# Altium schematic sheet Power.SchDoc
size A4; SheetNumber: 3; SheetTotal: 3
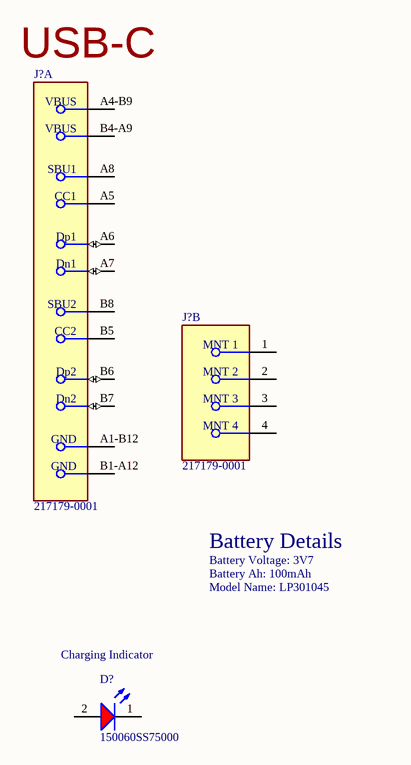
[diagram p0: Power.SchDoc]

## Parts
(Parts that share a designator on the sheet are numbered #1, #2 ... from top to bottom, then left to right.)
D?  150060SS75000  [WL-SMCW_0603_150060xx75000]
J?#1  217179-0001  [FP-2171790001-MFG]  (part A of 2)
J?#2  217179-0001  [FP-2171790001-MFG]  (part B of 2)

## Nets

Not connected (* = marked no-connect by the designer): D? 1(K) 2(A); J?#1 A1-B12(GND) A4-B9(VBUS) A5(CC1) A6(Dp1) A7(Dn1) A8(SBU1) B1-A12(GND) B4-A9(VBUS) B5(CC2) B6(Dp2) B7(Dn2) B8(SBU2); J?#2 1(MNT_1) 2(MNT_2) 3(MNT_3) 4(MNT_4)

## Notes on the sheet
- (near J?#1) USB-C
- Battery Voltage: 3V7
- Battery Ah: 100mAh
- Battery Details
- Model Name: LP301045
- Charging Indicator

## Library data of the parts
D? = CMP-1426-00004-3: Led, Red, 630 Nm, 1.9 V, 30 Ma, 60 Mcd Rohs Compliant: Yes; Dominant Wavelength: 630nm; Lens Style: Clear, Rectangular; Forward Current: 100mA; Test Current: 20mA; Viewing Angle: 140°; Forward Voltage: 1.9V; Peak Wavelength: 645nm; Max Reverse Voltage (DC): 5V; Luminous Intensity: 60mcd; Color: Red; Height: 700µm; Min Operating Temperature: -40°C; Case Code (Imperial): 0603; REACH SVHC: Unknown; RoHS: Compliant; Length: 1.6mm; Case Code (Metric): 1608; Mount: Surface Mount; Wavelength: 630nm; Packaging: Tape and Reel; Max Operating Temperature: 85°C; Width: 800µm; Case/Package: 0603
J?#1 J?#2 = CMP-04767-000028-2: CONN RCP USB2.0 TYP C 24P SMD RA; NexarPartId: 117190526; Gender: Receptacle; Number of Contacts: 16; Current Rating: 1.25A; Voltage Rating: 30V; Min Operating Temperature: -40°C; USB Standard: USB 2.0; Height: 3.36mm; Contact Material: Gold, Nickel; Max Operating Temperature: 85°C